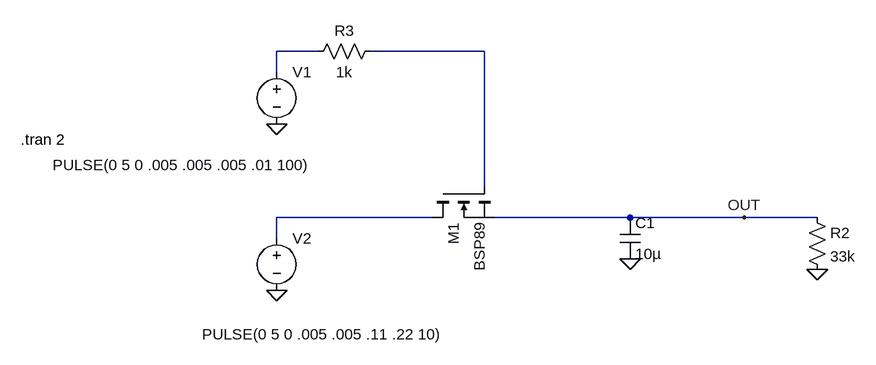
[diagram p0: schematic Draft1.asc]
Draft1.asc, the LTspice schematic file:
Version 4
SHEET 1 900 680
WIRE 64 -144 0 -144
WIRE 320 -144 144 -144
WIRE 0 -112 0 -144
WIRE 320 64 320 -144
WIRE 240 112 0 112
WIRE 544 112 336 112
WIRE 720 112 544 112
WIRE 832 112 720 112
WIRE 0 144 0 112
FLAG 0 224 0
FLAG 544 176 0
FLAG 832 192 0
FLAG 0 -32 0
FLAG 720 112 OUT
SYMBOL voltage 0 -128 R0
WINDOW 3 -345 159 Left 2
WINDOW 123 0 0 Left 0
WINDOW 39 0 0 Left 0
SYMATTR InstName V1
SYMATTR Value PULSE(0 5 0 .005 .005 .005 .01 100)
SYMBOL cap 528 112 R0
SYMATTR InstName C1
SYMATTR Value 10µ
SYMBOL res 816 96 R0
SYMATTR InstName R2
SYMATTR Value 33k
SYMBOL voltage 0 128 R0
WINDOW 3 -115 164 Left 2
WINDOW 123 0 0 Left 0
WINDOW 39 0 0 Left 0
SYMATTR InstName V2
SYMATTR Value PULSE(0 5 0 .005 .005 .11 .22 10)
SYMBOL res 160 -160 R90
WINDOW 0 0 56 VBottom 2
WINDOW 3 32 56 VTop 2
SYMATTR InstName R3
SYMATTR Value 1k
SYMBOL nmos 240 64 M90
SYMATTR InstName M1
SYMATTR Value BSP89
TEXT -394 -8 Left 2 !.tran 2

The netlist it stands for:
* Draft1.asc
V1 N001 0 PULSE(0 5 0 .005 .005 .005 .01 100)
C1 OUT 0 10µ
R2 OUT 0 33k
V2 N003 0 PULSE(0 5 0 .005 .005 .11 .22 10)
R3 N002 N001 1k
M1 N003 N002 OUT OUT BSP89
.model NMOS NMOS
.model PMOS PMOS
.lib standard.mos
.tran 2
.backanno
.end

* Results of the author's LTspice run, read from the files saved beside the schematic
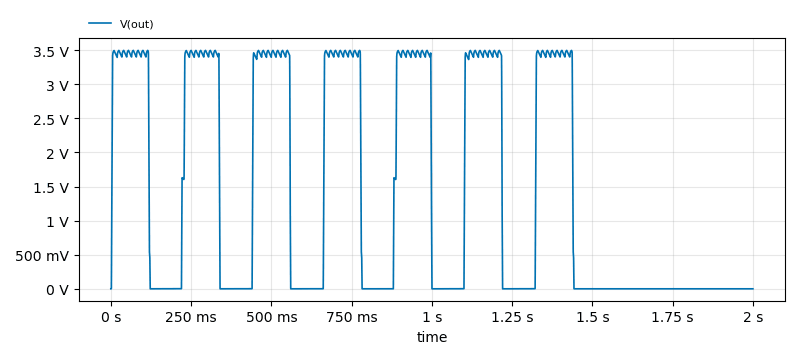
[diagram p1: Transient Analysis of Draft1.asc, plotted from the saved traces]
* Transient Analysis, 1 run:
*   V(out): min -12.17 µV, max 3.496 V, average 1.392 V, rms 2.179 V, last 0 V